# Altium schematic sheet uMultimeter_KEY_Sch.SchDoc: MicroMultimeter - KEY
size 127 x 101 mm; Author: Hom; CompanyName: KitSprout; DrawnBy: Hom; Engineer: Hom; Organization: KitSprout; Revision: B; SheetNumber: 1; SheetTotal: 1; License: CC BY-SA 4.0; Version: 2.0; LibVersion: 2.1; PageSetup: Record=PageOptions|CenterHorizontal=True|CenterVertical=True|PrintScale=1.00|XCorrection=1.00|YCorrection=1.00|PrintKind=0|BorderSize=5000000|LeftOffset=0|BottomOffset=0|Orientation=2|PaperLength=1000|PaperWidth=1000|Scale=100|PaperSource=7|PrintQuality=-3|MediaType=1|DitherType=10|PrintScaleMode=0|PaperKind=A4|PaperIndex=9
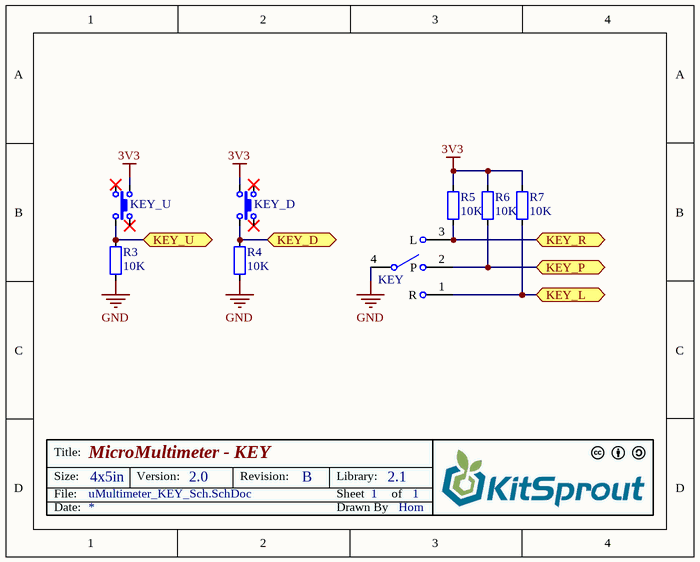
[diagram p0: uMultimeter_KEY_Sch.SchDoc]

## Parts
KEY  ButtonPushLever_11*12_90  [ButtonPushLever_11*12_90]  (value not drawn)
KEY_D  ButtonTACT  [ButtonTACT_3.5*3.55_90]  (value not drawn)
KEY_U  ButtonTACT  [ButtonTACT_3.5*3.55_90]  (value not drawn)
R3  value 10K  [RES_0603]  (hidden comment: Res_0603)
R4  value 10K  [RES_0603]  (hidden comment: Res_0603)
R5  value 10K  [RES_0603]  (hidden comment: Res_0603)
R6  value 10K  [RES_0603]  (hidden comment: Res_0603)
R7  value 10K  [RES_0603]  (hidden comment: Res_0603)

## Ports
KEY_D, KEY_L, KEY_P, KEY_R, KEY_U

## Nets
3V3: KEY_D.3 KEY_U.1 R5.2 R6.2 R7.2
GND: KEY.4 R3.1 R4.1
KEY_D: KEY_D.4 R4.2 ; port KEY_D
KEY_L: KEY.1(R) R7.1 ; port KEY_L
KEY_P: KEY.2(P) R6.1 ; port KEY_P
KEY_R: KEY.3(L) R5.1 ; port KEY_R
KEY_U: KEY_U.4 R3.2 ; port KEY_U

Not connected (* = marked no-connect by the designer): KEY_D 1* 2*; KEY_U 2* 3*

## Notes on the sheet
- Title:
- Size:
- Date:
- File:
- 4x5in
- Version:
- Revision:
- Sheet
- Drawn By
- Library:
- of

## Library data of the parts
KEY = ButtonPushLever_11*12_90: Button
KEY_D KEY_U = ButtonTACT: Button
R3-R7 = Res_0603: Resistor